# EAGLE board Motherboard V1.1 (EAGLE 9.6.2), part 1 of 2
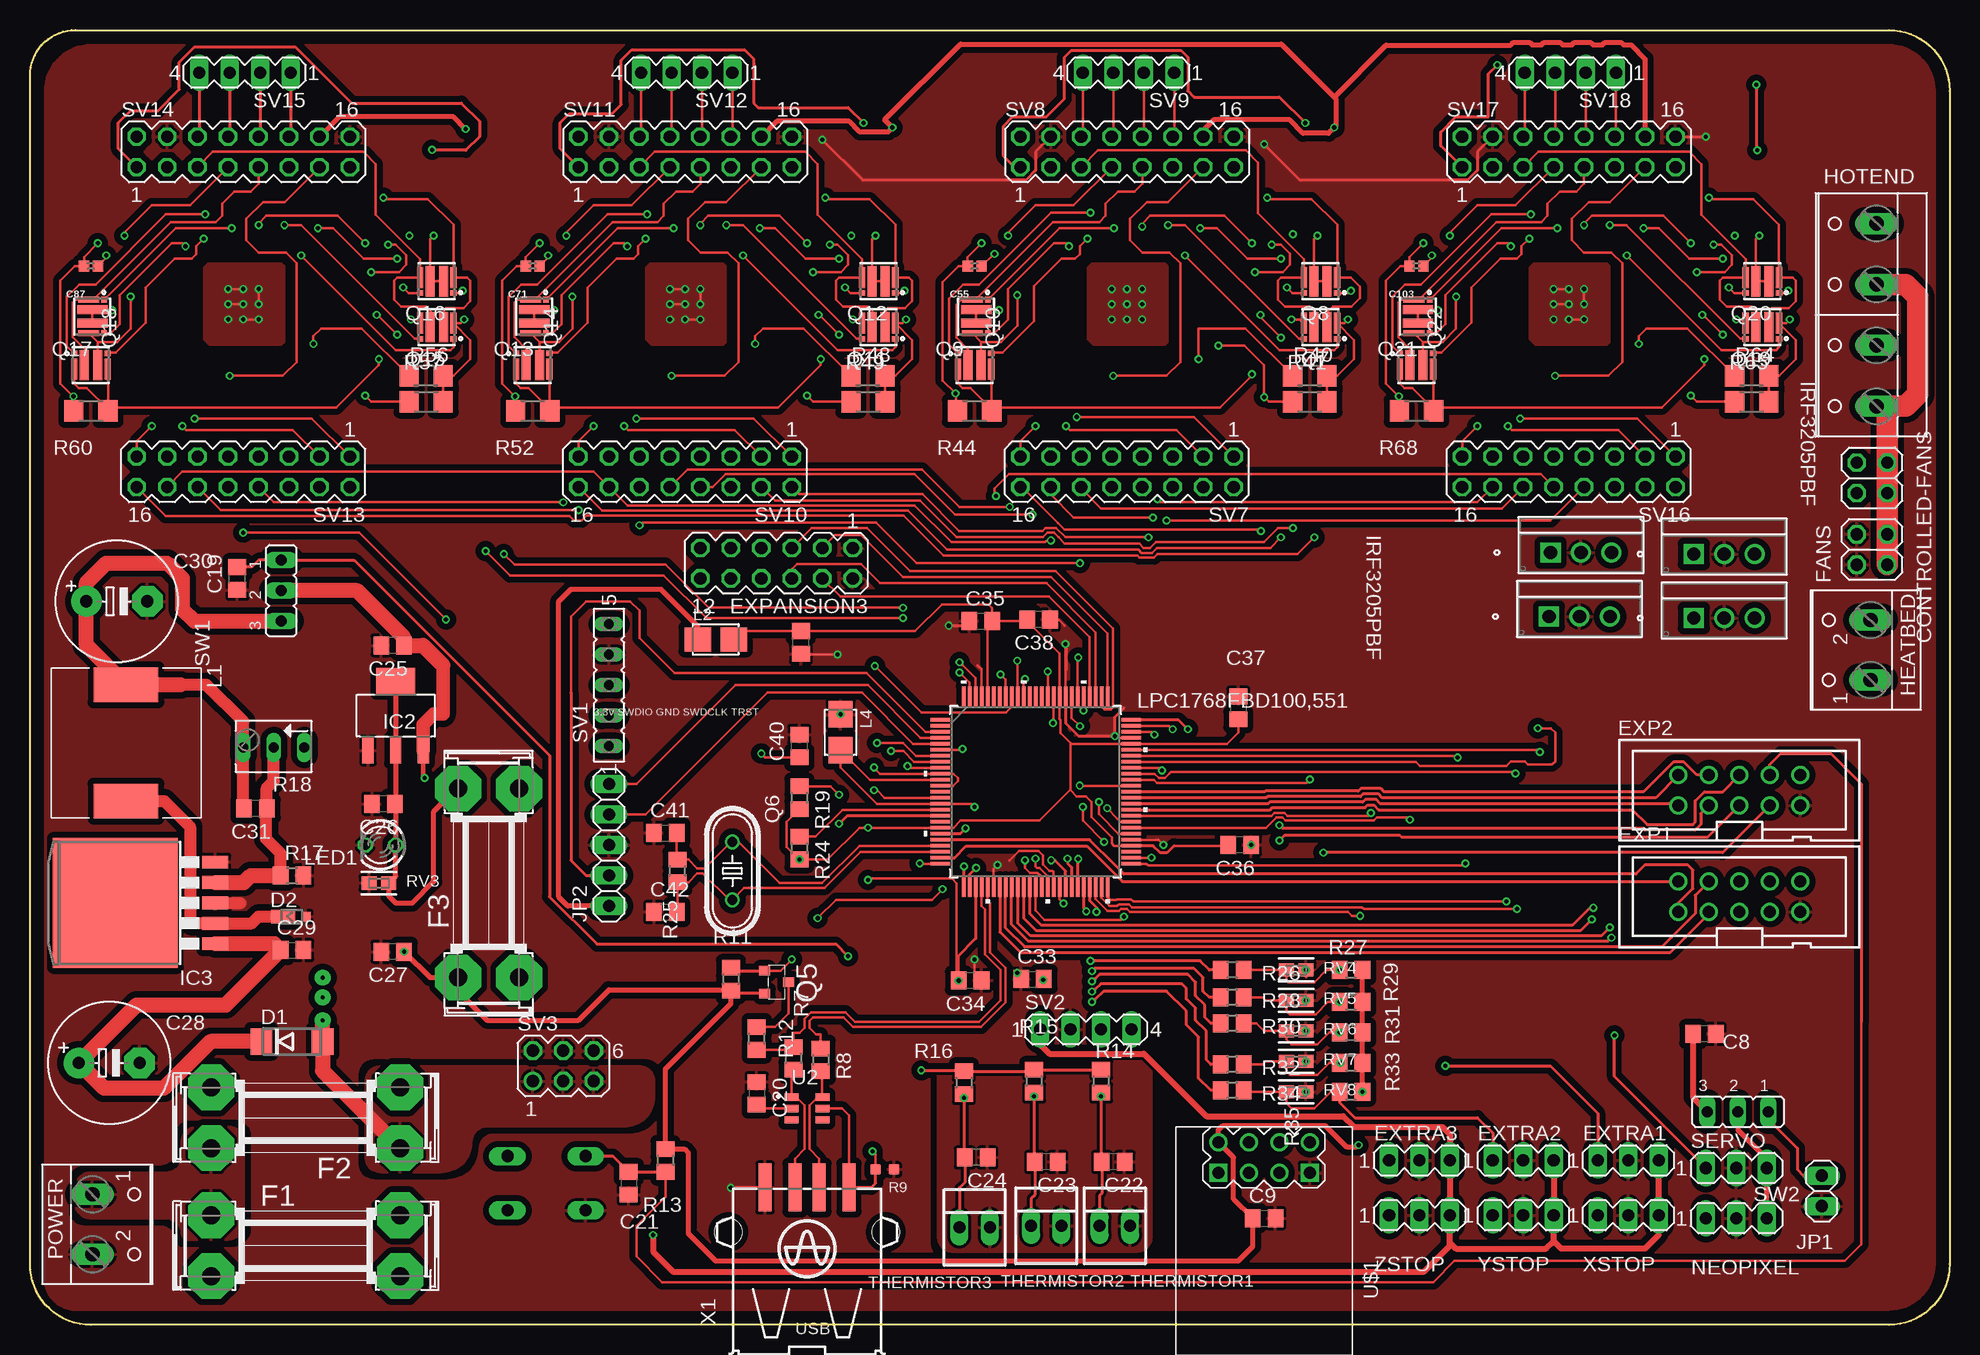
[diagram p5: board, top side]
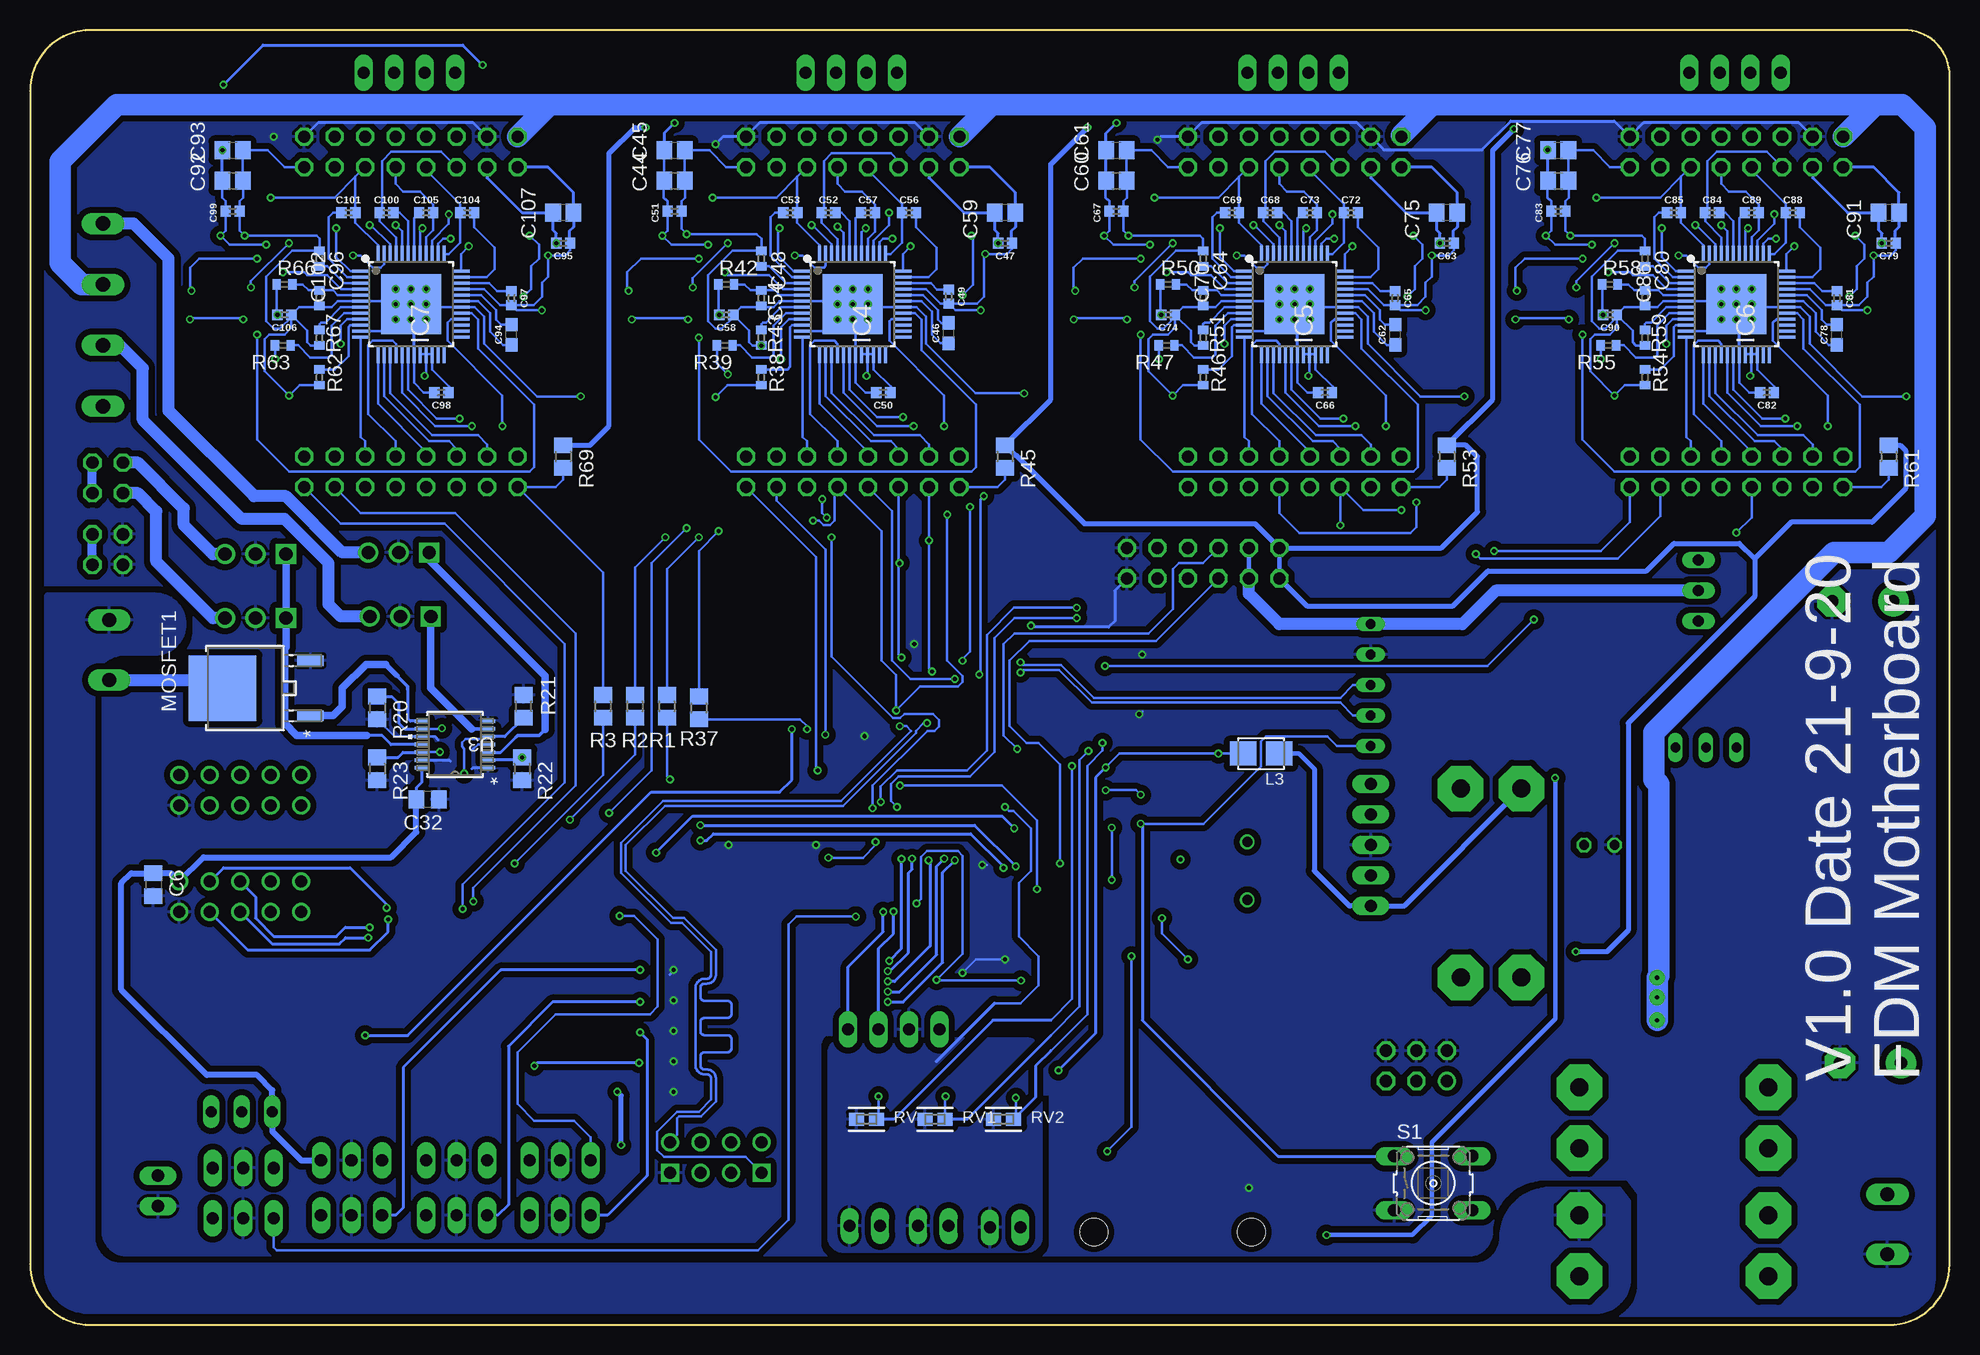
[diagram p6: board, bottom side, seen from below]

Size 160.02 x 107.95 mm. Coordinates in mm from the lower left corner, seen from the top.
Outline: 0,5.08 0,104.14 arc-90 3.81,107.95 154.94,107.95 arc-90 160.02,102.87 160.02,5.08 arc-90 154.94,0 5.08,0 arc-90 0,5.08
Copper layers (1*16): Top 0.035mm / dielectric 1.5mm / Bottom 0.035mm
Design rules "default *": minimum track width 8mil, minimum drill 0.3mm, track to track 8mil, track to pad 8mil, pad to pad 8mil, via to via 8mil, smd to smd 6mil, copper to edge 8mil, drill to drill 6mil, minimum pad ring 6mil, minimum via ring 6mil, stop-mask expansion 4mil, vias tented up to drill 0mil, thermal gap 10mil

## Footprints (pad centres in the part's own frame; a part is rotated, then mirrored left to right if it is on the bottom)
C0805 = smd 1.3 x 1.5: 1 -0.95,0; 2 0.95,0
E5-10,5 = drill 1.016 pad 2.54: + -2.54,0 | drill 1.016 pad 2.54 octagon: - 2.54,0
C0805' = smd 1.3 x 1.5: 1 -0.85,0; 2 0.85,0
0603 = smd 1.1 x 1: 1 -0.85,0; 2 0.85,0
0402 = smd 0.85 x 0.9: 1 -0.58,0; 2 0.58,0
C0402 = smd 0.7 x 0.9: 1 -0.65,0; 2 0.65,0
2X02 = drill 1.016 octagon: 1 -1.27,-1.27; 2 -1.27,1.27; 3 1.27,-1.27; 4 1.27,1.27
DO214AA = smd 1.8 x 2.2: A 2.55,0; C -2.55,0
POWERDI323 = smd 0.8 x 0.8: A 1.15,0 | smd 2 x 1.1: C -0.75,0
PAK100/2500-10 = drill 1 pad 1.422: 1 -5.08,-1.27; 2 -5.08,1.27; 3 -2.54,-1.27; 4 -2.54,1.27; 5 0,-1.27; 6 0,1.27; 7 2.54,-1.27; 8 2.54,1.27; 9 5.08,-1.27; 10 5.08,1.27
MA06-2 = drill 1.016 octagon: 1 -6.35,-1.27; 2 -6.35,1.27; 3 -3.81,-1.27; 4 -3.81,1.27; 5 -1.27,-1.27; 6 -1.27,1.27; 7 1.27,-1.27; 8 1.27,1.27; 9 3.81,-1.27; 10 3.81,1.27; 11 6.35,-1.27; 12 6.35,1.27
MA03-1 = drill 1.016 long: 1 -2.54,0; 2 0,0; 3 2.54,0
SHK20Q = drill 1.5 pad 3.81 octagon: 1A -7.874,2.54; 1B -7.874,-2.54; 2A 7.874,2.54; 2B 7.874,-2.54
W237-102 = drill 1.194 long: 1 -2.5,-1.27; 2 2.5,-1.27
W237-4P = drill 1.194 long: 1 -7.62,-0.635; 2 -2.54,-0.635; 3 2.54,-0.635; 4 7.62,-0.635
SOT223 = smd 0.95 x 2.15: 1 -2.3,-2.9; 2 0,-2.9; 3 2.3,-2.9 | smd 3.25 x 2.15: 4 0,2.9
TO263-5 = smd 1.067 x 2.159: 1 -3.404,-5.791; 2 -1.702,-5.791; 3 0,-5.791; 4 1.702,-5.791; 5 3.404,-5.791 | smd 10.8 x 10.41: 6 0,2.54
TQFP48-EP = smd 0.25 x 1.45: 1 -2.75,-4.175; 2 -2.25,-4.175; 3 -1.75,-4.175; 4 -1.25,-4.175; 5 -0.75,-4.175; 6 -0.25,-4.175; 7 0.25,-4.175; 8 0.75,-4.175; 9 1.25,-4.175; 10 1.75,-4.175; 11 2.25,-4.175; 12 2.75,-4.175; 25 2.75,4.175; 26 2.25,4.175; 27 1.75,4.175; 28 1.25,4.175; 29 0.75,4.175; 30 0.25,4.175; 31 -0.25,4.175; 32 -0.75,4.175; 33 -1.25,4.175; 34 -1.75,4.175; 35 -2.25,4.175; 36 -2.75,4.175 | smd 1.45 x 0.25: 13 4.175,-2.75; 14 4.175,-2.25; 15 4.175,-1.75; 16 4.175,-1.25; 17 4.175,-0.75; 18 4.175,-0.25; 19 4.175,0.25; 20 4.175,0.75; 21 4.175,1.25; 22 4.175,1.75; 23 4.175,2.25; 24 4.175,2.75; 37 -4.175,2.75; 38 -4.175,2.25; 39 -4.175,1.75; 40 -4.175,1.25; 41 -4.175,0.75; 42 -4.175,0.25; 43 -4.175,-0.25; 44 -4.175,-0.75; 45 -4.175,-1.25; 46 -4.175,-1.75; 47 -4.175,-2.25; 48 -4.175,-2.75 | smd 5 x 5: 49 0,0
1X02 = drill 1.016 long: 1 -1.27,0; 2 1.27,0
1X05 = drill 1.016 long: 1 -5.08,0; 2 -2.54,0; 3 0,0; 4 2.54,0; 5 5.08,0
INDP125125X600N = smd 2.9 x 5.4: 1 -4.85,0; 2 4.85,0
M1331 = smd 2.2 x 2: 1 -1.5,0; 2 1.5,0
LED3MM = drill 0.813 octagon: A -1.27,0; K 1.27,0
D-PAK_TO-252AA_INF-L = smd 0.889 x 2.184: 1 -2.29,-5.474; 3 2.29,-5.474 | smd 5.461 x 5.613: 2 0,1.854
MICRO3 = smd 0.8 x 0.9: 1 -0.95,-1; 2 0.95,-1; 3 0,1
HC49/S = drill 0.813: 1 -2.413,0; 2 2.413,0
TRANS_FDMC8030 = smd 0.52 x 0.45: 1 -1.39,0.975; 8 1.39,0.975 | smd 0.52 x 1.75: 4 -1.39,-0.325; 5 1.39,-0.325 | smd 0.75 x 2.52: 9 0.55,0; 10 -0.55,0
R0805 = smd 1.3 x 1.5: 1 -0.95,0; 2 0.95,0
R0603 = smd 0.889 x 0.889: 1 0,0.762; 2 0,-0.762
B64Y = drill 0.813 long: A 2.54,0; E -2.54,0; S 0,0
R0402 = smd 0.7 x 0.9: 1 -0.65,0; 2 0.65,0
R1206 = smd 1.6 x 1.803: 1 -1.422,0; 2 1.422,0
BOURNS_INC._CG0603MLC-3.3LE_1 = smd 1.255 x 1.106: 1 -0.826,0; 2 0.826,0
B3F-10XX = drill 1.016 long: 1 -3.251,2.261; 2 3.251,2.261; 3 -3.251,-2.261; 4 3.251,-2.261
FE05-1 = drill 0.813 long: 1 -5.08,0; 2 -2.54,0; 3 0,0; 4 2.54,0; 5 5.08,0
MA04-1 = drill 1.016 long: 1 -3.81,0; 2 -1.27,0; 3 1.27,0; 4 3.81,0
MA03-2 = drill 1.016: 1 -2.54,-1.27 | drill 1.016 octagon: 2 -2.54,1.27; 3 0,-1.27; 4 0,1.27; 5 2.54,-1.27; 6 2.54,1.27
MA08-2 = drill 1.016 octagon: 1 -8.89,-1.27; 2 -8.89,1.27; 3 -6.35,-1.27; 4 -6.35,1.27; 5 -3.81,-1.27; 6 -3.81,1.27; 7 -1.27,-1.27; 8 -1.27,1.27; 9 1.27,-1.27; 10 1.27,1.27; 11 3.81,-1.27; 12 3.81,1.27; 13 6.35,-1.27; 14 6.35,1.27; 15 8.89,-1.27; 16 8.89,1.27
JP2 = drill 0.914 long: 1 -2.54,0; 2 0,0; 3 2.54,0
22-23-2021 = drill 1 long: 1 -1.27,0; 2 1.27,0
LQFP100_14X14_NXP = smd 1.625 x 0.28: 1 -7.963,6; 2 -7.963,5.5; 3 -7.963,5; 4 -7.963,4.5; 5 -7.963,4; 6 -7.963,3.5; 7 -7.963,3; 8 -7.963,2.5; 9 -7.963,2; 10 -7.963,1.5; 11 -7.963,1; 12 -7.963,0.5; 13 -7.963,0; 14 -7.963,-0.5; 15 -7.963,-1; 16 -7.963,-1.5; 17 -7.963,-2; 18 -7.963,-2.5; 19 -7.963,-3; 20 -7.963,-3.5; 21 -7.963,-4; 22 -7.963,-4.5; 23 -7.963,-5; 24 -7.963,-5.5; 25 -7.963,-6; 51 7.963,-6; 52 7.963,-5.5; 53 7.963,-5; 54 7.963,-4.5; 55 7.963,-4; 56 7.963,-3.5; 57 7.963,-3; 58 7.963,-2.5; 59 7.963,-2; 60 7.963,-1.5; 61 7.963,-1; 62 7.963,-0.5; 63 7.963,0; 64 7.963,0.5; 65 7.963,1; 66 7.963,1.5; 67 7.963,2; 68 7.963,2.5; 69 7.963,3; 70 7.963,3.5; 71 7.963,4; 72 7.963,4.5; 73 7.963,5; 74 7.963,5.5; 75 7.963,6 | smd 0.28 x 1.625: 26 -6,-7.963; 27 -5.5,-7.963; 28 -5,-7.963; 29 -4.5,-7.963; 30 -4,-7.963; 31 -3.5,-7.963; 32 -3,-7.963; 33 -2.5,-7.963; 34 -2,-7.963; 35 -1.5,-7.963; 36 -1,-7.963; 37 -0.5,-7.963; 38 0,-7.963; 39 0.5,-7.963; 40 1,-7.963; 41 1.5,-7.963; 42 2,-7.963; 43 2.5,-7.963; 44 3,-7.963; 45 3.5,-7.963; 46 4,-7.963; 47 4.5,-7.963; 48 5,-7.963; 49 5.5,-7.963; 50 6,-7.963; 76 6,7.963; 77 5.5,7.963; 78 5,7.963; 79 4.5,7.963; 80 4,7.963; 81 3.5,7.963; 82 3,7.963; 83 2.5,7.963; 84 2,7.963; 85 1.5,7.963; 86 1,7.963; 87 0.5,7.963; 88 0,7.963; 89 -0.5,7.963; 90 -1,7.963; 91 -1.5,7.963; 92 -2,7.963; 93 -2.5,7.963; 94 -3,7.963; 95 -3.5,7.963; 96 -4,7.963; 97 -4.5,7.963; 98 -5,7.963; 99 -5.5,7.963; 100 -6,7.963
SOP95P275X110-6N = smd 1.15 x 0.6: 1 -1.3,0.95; 2 -1.3,0; 3 -1.3,-0.95; 4 1.3,-0.95; 5 1.3,0; 6 1.3,0.95
TSSOP14_4P50X5P10_ONS-L = smd 1.156 x 0.305: 1 -2.775,1.95; 2 -2.775,1.3; 3 -2.775,0.65; 4 -2.775,0; 5 -2.775,-0.65; 6 -2.775,-1.3; 7 -2.775,-1.95; 8 2.775,-1.95; 9 2.775,-1.3; 10 2.775,-0.65; 11 2.775,0; 12 2.775,0.65; 13 2.775,1.3; 14 2.775,1.95
PG-TO220-3_INF = drill 1.118 pad 1.626 square: 1 0,0 | drill 1.118 pad 1.626: 2 2.54,0; 3 5.08,0
WIRELESS-WIFI-ESP-01 = drill 1 square: A1 -8.89,3.81; D1 -8.89,-3.81 | drill 1: A2 -11.43,3.81; B1 -8.89,1.27; B2 -11.43,1.27; C1 -8.89,-1.27; C2 -11.43,-1.27; D2 -11.43,-3.81
USB-A003 = smd 1.12 x 4: 1 -3.5,14; 2 -1,14; 3 1,14; 4 3.5,14 | hole 2.3: -6.57,10.28; 6.57,10.28

## Placement (x,y rotation side)
C6  22UF  [C0805]  149.73,36.7 270 bottom
C8  22UF  [C0805]  139.57,24.26 180 top
C9  22UF  [C0805]  102.87,8.89 0 top
C19  0.1UF  [C0805]  17.27,62.23 90 top
C20  4700PF  [C0805]  60.58,19.3 270 top
C21  0.1UF  [C0805]  49.91,11.81 270 top
C22  22UF  [C0805]  90.3,13.59 180 top
C23  22UF  [C0805]  84.71,13.59 180 top
C24  22UF  [C0805]  78.87,13.97 180 top
C25  0.1UF  [C0805]  30.23,56.64 180 top
C26  10UF  [C0805]  29.46,43.43 180 top
C27  22UF  [C0805]  30.23,31.12 180 top
C28  220UF  [E5-10,5]  6.6,21.84 0 top
C29  100nF  [C0805]  21.84,31.24 0 top
C30  200UF  [E5-10,5]  7.24,60.32 0 top
C31  100nF  [C0805]  18.8,43.05 180 top
C32  0.1UF  [C0805]  126.87,43.81 180 bottom
C33  0.1UF  [C0805]  83.57,28.83 0 top
C34  0.1UF  [C0805]  78.36,28.7 180 top
C35  0.1UF  [C0805]  79.25,58.67 0 top
C36  0.1UF  [C0805]  100.84,40 180 top
C37  0.1UF  [C0805]  100.71,51.43 270 top
C38  0.1UF  [C0805]  84.07,58.8 180 top
C39  0.1UF  [C0805]  64.26,56.9 90 top
C40  0.1UF  [C0805]  64.13,48.26 90 top
C41  18PF  [C0805]  52.96,41.02 0 top
C42  18PF  [C0805]  52.96,34.42 0 top
C44  10uF  [C0805']  106.3,95.38 0 bottom
C45  10uF  [C0805']  106.3,97.92 0 bottom
C46  22nF  [0603]  83.44,82.68 90 bottom
C47  470nF  [0402]  78.74,90.17 180 bottom
C48  2.2uF  [C0402]  99.06,88.9 270 bottom
C49  0.1uF  [0402]  83.44,85.72 270 bottom
C50  0.1uF  [0402]  88.9,77.72 180 bottom
C51  0.1uF  [0402]  106.3,92.84 0 bottom
C52  0.1uF  [0402]  93.47,92.71 0 bottom
C53  0.1uF  [0402]  96.65,92.71 0 bottom
C54  2.2uF  [C0402]  99.06,85.6 90 bottom
C55  470nF  [0402]  78.74,88.27 180 top
C56  0.1uF  [0402]  86.74,92.71 0 bottom
C57  0.1uF  [0402]  90.17,92.71 0 bottom
C58  470nF  [0402]  101.98,84.2 180 bottom
C59  10uF  [C0805']  78.74,92.71 180 bottom
C60  10uF  [C0805']  69.47,95.38 0 bottom
C61  10uF  [C0805']  69.47,97.92 0 bottom
C62  22nF  [0603]  46.23,82.55 90 bottom
C63  470nF  [0402]  41.91,90.17 180 bottom
C64  2.2uF  [C0402]  62.23,88.9 270 bottom
C65  0.1uF  [0402]  46.23,85.6 270 bottom
C66  0.1uF  [0402]  52.07,77.72 180 bottom
C67  0.1uF  [0402]  69.47,92.84 0 bottom
C68  0.1uF  [0402]  56.64,92.71 0 bottom
C69  0.1uF  [0402]  59.82,92.71 0 bottom
C70  2.2uF  [C0402]  62.23,85.6 90 bottom
C71  470nF  [0402]  41.91,88.27 180 top
C72  0.1uF  [0402]  49.91,92.71 0 bottom
C73  0.1uF  [0402]  53.34,92.71 0 bottom
C74  470nF  [0402]  65.15,84.2 180 bottom
C75  10uF  [C0805']  41.91,92.71 180 bottom
C76  10uF  [C0805']  32.64,95.38 0 bottom
C77  10uF  [C0805']  32.64,97.92 0 bottom
C78  22nF  [0603]  9.4,82.55 90 bottom
C79  470nF  [0402]  5.08,90.17 180 bottom
C80  2.2uF  [C0402]  25.4,88.9 270 bottom
C81  0.1uF  [0402]  9.4,85.6 270 bottom
C82  0.1uF  [0402]  15.24,77.72 180 bottom
C83  0.1uF  [0402]  32.64,92.84 0 bottom
C84  0.1uF  [0402]  19.81,92.71 0 bottom
C85  0.1uF  [0402]  22.99,92.71 0 bottom
C86  2.2uF  [C0402]  25.4,85.6 90 bottom
C87  470nF  [0402]  5.08,88.27 180 top
C88  0.1uF  [0402]  13.08,92.71 0 bottom
C89  0.1uF  [0402]  16.51,92.71 0 bottom
C90  470nF  [0402]  28.32,84.2 180 bottom
C91  10uF  [C0805']  5.08,92.71 180 bottom
C92  10uF  [C0805']  143.13,95.38 0 bottom
C93  10uF  [C0805']  143.13,97.92 0 bottom
C94  22nF  [0603]  119.89,82.55 90 bottom
C95  470nF  [0402]  115.57,90.17 180 bottom
C96  2.2uF  [C0402]  135.89,88.9 270 bottom
C97  0.1uF  [0402]  119.89,85.6 270 bottom
C98  0.1uF  [0402]  125.73,77.72 180 bottom
C99  0.1uF  [0402]  143.13,92.84 0 bottom
C100  0.1uF  [0402]  130.3,92.71 0 bottom
C101  0.1uF  [0402]  133.48,92.71 0 bottom
C102  2.2uF  [C0402]  135.89,85.6 90 bottom
C103  470nF  [0402]  115.57,88.27 180 top
C104  0.1uF  [0402]  123.57,92.71 0 bottom
C105  0.1uF  [0402]  127,92.71 0 bottom
C106  470nF  [0402]  138.81,84.2 180 bottom
C107  10uF  [C0805']  115.57,92.71 180 bottom
CONTROLLED-FANS  [2X02]  153.54,70.61 90 top
D1  [DO214AA]  21.84,23.62 0 top
D2  PD3S160  [POWERDI323]  21.84,34.04 0 top
EXP1  2510-  [PAK100/2500-10]  142.49,35.69 0 top
EXP2  2510-  [PAK100/2500-10]  142.49,44.58 0 top
EXPANSION3  [MA06-2]  62.23,63.5 180 top
EXTRA1  [MA03-1]  133.22,13.72 0 top
EXTRA2  [MA03-1]  124.46,13.72 0 top
EXTRA3  [MA03-1]  115.82,13.72 0 top
F1  20A  [SHK20Q]  22.99,6.6 0 top
F2  10A  [SHK20Q]  22.99,17.27 180 top
F3  7.5A  [SHK20Q]  38.23,36.83 90 top
FANS  [2X02]  153.54,64.64 90 top
HEATBED  [W237-102]  152.15,56.26 90 top
HOTEND  [W237-4P]  153.29,84.2 90 top
IC2  LM1117MP-3.3  [SOT223]  30.48,50.8 0 top
IC3  LM2596S  [TO263-5]  9.65,35.18 90 top
IC4  TMC5160-TA  [TQFP48-EP]  91.44,85.09 270 bottom
IC5  TMC5160-TA  [TQFP48-EP]  54.61,85.09 270 bottom
IC6  TMC5160-TA  [TQFP48-EP]  17.78,85.09 270 bottom
IC7  TMC5160-TA  [TQFP48-EP]  128.27,85.09 270 bottom
JP1  [1X02]  149.35,11.18 90 top
JP2  swd  [1X05]  48.26,40 90 top
L1  SRR1260-331K  [INDP125125X600N]  8,48.51 270 top
L2  FB-M1331  [M1331]  57.15,57.15 0 top
L3  FB-M1331  [M1331]  57.4,47.62 180 bottom
L4  FB-M1331  [M1331]  67.56,49.4 270 top
LED1  TLLR4400  [LED3MM]  29.21,40 180 top
MOSFET1  IRLR8743PBFD-PAK_TO-252AA_INF-L  [D-PAK_TO-252AA_INF-L]  142.11,53.09 90 bottom
NEOPIXEL  [MA03-1]  142.24,8.89 0 top
POWER  [W237-102]  6.48,8.38 270 top
Q5  IRLML5203  [MICRO3]  62.23,28.58 270 top
Q6  120MHZ  [HC49/S]  58.55,37.85 270 top
Q7  FDMC8030  [TRANS_FDMC8030]  107.57,83.19 180 top
Q8  FDMC8030  [TRANS_FDMC8030]  107.57,87 180 top
Q9  FDMC8030  [TRANS_FDMC8030]  78.74,80.01 0 top
Q10  FDMC8030  [TRANS_FDMC8030]  78.87,84.07 270 top
Q11  FDMC8030  [TRANS_FDMC8030]  70.74,83.19 180 top
Q12  FDMC8030  [TRANS_FDMC8030]  70.74,87 180 top
Q13  FDMC8030  [TRANS_FDMC8030]  41.91,80.01 0 top
Q14  FDMC8030  [TRANS_FDMC8030]  42.04,84.07 270 top
Q15  FDMC8030  [TRANS_FDMC8030]  33.91,83.19 180 top
Q16  FDMC8030  [TRANS_FDMC8030]  33.91,87 180 top
Q17  FDMC8030  [TRANS_FDMC8030]  5.08,80.01 0 top
Q18  FDMC8030  [TRANS_FDMC8030]  5.21,84.07 270 top
Q19  FDMC8030  [TRANS_FDMC8030]  144.4,83.19 180 top
Q20  FDMC8030  [TRANS_FDMC8030]  144.4,87 180 top
Q21  FDMC8030  [TRANS_FDMC8030]  115.57,80.01 0 top
Q22  FDMC8030  [TRANS_FDMC8030]  115.7,84.07 270 top
R1  100  [R0805]  106.93,51.56 270 bottom
R2  100  [R0805]  109.6,51.56 270 bottom
R3  100  [R0805]  112.27,51.56 270 bottom
R7  27  [R0805]  63.63,22.23 270 top
R8  27  [R0805]  65.91,22.1 270 top
R9  SMD-RES-VARISTOR-5V-28V(0603)  [R0603]  71.25,12.95 90 top
R11  1.5K  [R0805]  58.42,28.83 270 top
R12  1.5K  [R0805]  60.58,23.88 90 top
R13  4.7K  [R0805]  52.96,13.72 270 top
R14  4.7K  [R0805]  89.28,20.32 270 top
R15  4.7K  [R0805]  83.69,20.32 270 top
R16  4.7K  [R0805]  77.85,20.19 270 top
R17  330  [R0805]  21.84,37.46 0 top
R18  10k  [B64Y]  20.32,48.13 180 top
R19  10k  [R0805]  64.13,43.94 270 top
R20  10k  [R0805]  131.06,51.43 270 bottom
R21  10k  [R0805]  118.87,51.56 90 bottom
R22  10k  [R0805]  119,46.35 270 bottom
R23  10k  [R0805]  131.06,46.35 270 bottom
R24  10k  [R0805]  64.13,39.75 270 top
R25  1M  [R0805]  53.97,37.85 90 top
R26  1k  [R0805]  100.2,29.59 180 top
R27  10K  [R0805]  110.11,29.59 0 top
R28  1k  [R0805]  100.2,27.3 180 top
R29  10K  [R0805]  110.11,26.92 0 top
R30  1k  [R0805]  100.2,25.15 180 top
R31  10K  [R0805]  110.11,24.38 0 top
R32  1k  [R0805]  100.2,21.72 180 top
R33  10K  [R0805]  110.11,21.84 0 top
R34  1k  [R0805]  100.2,19.56 180 top
R35  10K  [R0805]  110.11,19.43 0 top
R37  100  [R0805]  104.27,51.43 270 bottom
R38  47  [R0402]  99.06,78.99 90 bottom
R39  47  [R0402]  102.11,81.66 180 bottom
R40  0.075  [R1206]  106.68,79.12 0 top
R41  0.075  [R1206]  106.68,76.96 180 top
R42  2.2  [R0402]  101.98,86.74 0 bottom
R43  47  [R0402]  99.06,82.3 90 bottom
R44  0.075  [R1206]  78.74,76.2 180 top
R45  10k  [R0805]  78.74,72.39 270 bottom
R46  47  [R0402]  62.23,78.99 90 bottom
R47  47  [R0402]  65.28,81.66 180 bottom
R48  0.075  [R1206]  69.85,79.12 0 top
R49  0.075  [R1206]  69.85,76.96 180 top
R50  2.2  [R0402]  65.15,86.74 0 bottom
R51  47  [R0402]  62.23,82.3 90 bottom
R52  0.075  [R1206]  41.91,76.2 180 top
R53  10k  [R0805]  41.91,72.39 270 bottom
R54  47  [R0402]  25.4,78.99 90 bottom
R55  47  [R0402]  28.45,81.66 180 bottom
R56  0.075  [R1206]  33.02,79.12 0 top
R57  0.075  [R1206]  33.02,76.96 180 top
R58  2.2  [R0402]  28.32,86.74 0 bottom
R59  47  [R0402]  25.4,82.3 90 bottom
R60  0.075  [R1206]  5.08,76.2 180 top
R61  10k  [R0805]  5.08,72.39 270 bottom
R62  47  [R0402]  135.89,78.99 90 bottom
R63  47  [R0402]  138.94,81.66 180 bottom
R64  0.075  [R1206]  143.51,79.12 0 top
R65  0.075  [R1206]  143.51,76.96 180 top
R66  2.2  [R0402]  138.81,86.74 0 bottom
R67  47  [R0402]  135.89,82.3 90 bottom
R68  0.075  [R1206]  115.57,76.2 180 top
R69  10k  [R0805]  115.57,72.39 270 bottom
RV  BOURNS_INC._CG0603MLC-3.3LEBOURNS_INC._CG0603MLC-3.3LE_0_1  [BOURNS_INC._CG0603MLC-3.3LE_1]  90.3,17.14 0 bottom
RV1  BOURNS_INC._CG0603MLC-3.3LEBOURNS_INC._CG0603MLC-3.3LE_0_1  [BOURNS_INC._CG0603MLC-3.3LE_1]  84.58,17.14 0 bottom
RV2  BOURNS_INC._CG0603MLC-3.3LEBOURNS_INC._CG0603MLC-3.3LE_0_1  [BOURNS_INC._CG0603MLC-3.3LE_1]  78.87,17.14 0 bottom
RV3  BOURNS_INC._CG0603MLC-3.3LEBOURNS_INC._CG0603MLC-3.3LE_0_1  [BOURNS_INC._CG0603MLC-3.3LE_1]  29.08,36.83 0 top
RV4  BOURNS_INC._CG0603MLC-3.3LEBOURNS_INC._CG0603MLC-3.3LE_0_1  [BOURNS_INC._CG0603MLC-3.3LE_1]  105.54,29.59 0 top
RV5  BOURNS_INC._CG0603MLC-3.3LEBOURNS_INC._CG0603MLC-3.3LE_0_1  [BOURNS_INC._CG0603MLC-3.3LE_1]  105.54,27.05 0 top
RV6  BOURNS_INC._CG0603MLC-3.3LEBOURNS_INC._CG0603MLC-3.3LE_0_1  [BOURNS_INC._CG0603MLC-3.3LE_1]  105.54,24.51 0 top
RV7  BOURNS_INC._CG0603MLC-3.3LEBOURNS_INC._CG0603MLC-3.3LE_0_1  [BOURNS_INC._CG0603MLC-3.3LE_1]  105.54,21.97 0 top
RV8  BOURNS_INC._CG0603MLC-3.3LEBOURNS_INC._CG0603MLC-3.3LE_0_1  [BOURNS_INC._CG0603MLC-3.3LE_1]  105.54,19.43 0 top
S1  [B3F-10XX]  43.05,11.81 0 bottom
SERVO  [MA03-1]  142.24,13.08 0 top
SV1  [FE05-1]  48.26,53.34 90 top
SV2  [MA04-1]  88.01,24.64 0 top
SV3  [MA03-2]  44.45,21.59 0 top
SV7  [MA08-2]  91.44,71.12 180 top
SV8  [MA08-2]  91.44,97.79 0 top
SV9  [MA04-1]  91.57,104.39 180 top
SV10  [MA08-2]  54.61,71.12 180 top
SV11  [MA08-2]  54.61,97.79 0 top
SV12  [MA04-1]  54.74,104.39 180 top
SV13  [MA08-2]  17.78,71.12 180 top
SV14  [MA08-2]  17.78,97.79 0 top
SV15  [MA04-1]  17.91,104.39 180 top
SV16  [MA08-2]  128.27,71.12 180 top
SV17  [MA08-2]  128.27,97.79 0 top
SV18  [MA04-1]  128.4,104.39 180 top
SW1  [JP2]  20.96,61.21 270 top
SW2  [JP2]  142.37,17.78 180 top
THERMISTOR1  22-23-2021  [22-23-2021]  90.42,8.25 0 top
THERMISTOR2  22-23-2021  [22-23-2021]  84.71,8.25 0 top
THERMISTOR3  22-23-2021  [22-23-2021]  78.74,8.13 0 top
U1  LPC1768FBD100,551  [LQFP100_14X14_NXP]  83.82,44.45 0 top
U2  NUP2114UCMR6T1G  [SOP95P275X110-6N]  64.77,18.03 0 top
U3  MC74HCT125ADTR2GTSSOP14_4P50X5P10_ONS-L  [TSSOP14_4P50X5P10_ONS-L]  124.59,48.39 180 bottom
U4  IRF3205PBF  [PG-TO220-3_INF]  126.75,64.39 0 top
U5  IRF3205PBF  [PG-TO220-3_INF]  126.62,59.05 0 top
U6  IRF3205PBF  [PG-TO220-3_INF]  138.68,64.26 0 top
U7  IRF3205PBF  [PG-TO220-3_INF]  138.68,58.93 0 top
U$1  WIRELESS-WIFI-ESP-01  [WIRELESS-WIFI-ESP-01]  102.87,3.81 270 top
X1  [USB-A003]  64.77,-2.54 0 top
XSTOP  [MA03-1]  133.22,9.14 0 top
YSTOP  [MA03-1]  124.46,9.14 0 top
ZSTOP  [MA03-1]  115.82,9.14 0 top

## Tracks (layer width: path | path; a pad name or v marks a point on that pad's centre or on a via)
1A
  Top 0.203: SV18.2 129.67,99.19 SV17.10
1B
  Top 0.203: SV18.1 132.21,99.19 SV17.12
2A
  Top 0.203: SV18.3 127.13,99.19 SV17.8
2B
  Top 0.203: SV18.4 124.59,99.19 SV17.6
3.3VDC  (via drill 0.35)
  Top 0.254: 58.36,27.94 R11.2 58.67,27.62 Q5.2 | 110.62,14.86 v110.74,14.99
  Top 0.406: C27.1 33.34,28.96 F3.1A 35.69,27.81 38.1,25.4 45.72,25.4 48.26,27.94 58.36,27.94 | R11.2 58.42,26.8 52.96,21.34 R13.1 54.55,14.67 54.86,14.35 54.86,7.62 57.15,5.33 100.71,5.33 101.92,6.54 C9.1 100.33,10.48 100.33,13.97 U$1.D2 99.06,16.26 99.44,16.64 107.95,16.64 109.73,14.86 110.62,14.86 | R35.2 R33.2 R31.2 R29.2 R27.2 | SV8.14 97.79,99.57 98.68,100.46 105.01,100.46 106.12,99.34 108.23,99.34 v108.71,99.82 108.84,99.95 108.84,102.23 108.71,102.36 | SV11.14 62.23,100.33 68.3,100.33 69.16,99.47 71.53,99.47 v71.88,99.82 71.25,100.46 77.57,106.78 104.29,106.78 108.71,102.36 | v36.32,99.69 35.31,100.71 25.78,100.71 SV14.14 | 108.71,102.36 113.03,106.68 123.43,106.68 123.66,106.91 125.01,106.91 125.21,106.7 126,106.7 126.2,106.91 127.55,106.91 127.75,106.7 128.54,106.7 128.74,106.91 130.09,106.91 130.29,106.7 131.08,106.7 131.28,106.91 132.63,106.91 132.83,106.7 133.44,106.7 134.62,105.53 SV17.14
  Bottom 0.381: EXPANSION3.12 EXPANSION3.11
  Bottom 0.406: v110.74,14.99 110.74,19.12 R35.2 | EXPANSION3.12 53.59,59.94 41.4,59.94 38.48,62.86 25.27,62.86 22.99,65.15 17.53,65.15 16.26,63.88 | 16.26,63.88 16.26,60.71 26.8,50.16 26.8,32.89 28.57,31.12 C27.1 | R61.1 4.12,73.34 3.68,72.9 3.68,69.72 6.48,66.93 13.21,66.93 16.26,63.88 | R69.1 113.35,73.34 111.76,74.93 111.76,97.66 109.6,99.82 v108.71,99.82 | v71.88,99.82 74.93,96.77 74.93,77.15 R45.1 77.9,72.5 77.82,72.5 72.13,66.8 57.91,66.8 EXPANSION3.11 42.37,64.77 39.37,67.77 39.37,72.39 40.32,73.34 R53.1 38.1,77.15 38.1,97.92 v36.32,99.69
  other vias: 111.06,19.43 31.18,31.12
5V-OUT
  Top 1.016: C31.2 17.78,43.12 R18.A 17.78,50.29 14.71,53.36 12.55,53.36
  Top 1.27: 12.55,53.36 L1.1 4.7,56.67 C30.+ 4.7,61.85 6.35,63.5 11.43,63.5 12.7,62.23 12.7,59.69 13.72,58.67 SW1.3
+3.3V
  Top 0.406: IC2.4 IC2.2 30.48,43.5 | 30.48,43.37 LED1.A 30.48,37.4 RV3.2 29.91,35.75 30.48,35.18 31.88,35.18 33.66,36.96 33.66,42.8 35.56,44.7 F3.2A | JP2.1 44.83,34.92 44.07,35.69 44.07,60.32 45.09,61.34 52.58,61.34 55.65,58.27 L2.1
  Top 0.762: 30.48,43.5 C26.1 30.48,43.37
  Bottom 0.356: L3.1 54.23,47.62 52.96,46.35
  Bottom 0.406: F3.2A 45.47,34.92 JP2.1 50.04,34.92 52.96,37.85 52.96,46.35
+5V  (via drill 0.35)
  Top 0.254: ZSTOP.3 118.36,8.89 118.36,6.86
  Top 0.305: 32.78,45.73 32.77,45.72 v32.89,45.59
  Top 0.381: XSTOP.3 135.76,7.49 | IC2.3 32.78,45.73
  Top 0.508: 118.36,6.86 118.87,6.35 126.37,6.35 127,6.99 | 127,6.99 YSTOP.3 EXTRA2.3 | 135.76,7.49 134.62,6.35 127.63,6.35 127,6.99 | XSTOP.3 EXTRA1.3 | ZSTOP.3 EXTRA3.3 118.36,15.88 117.74,16.5 110.34,16.5 109.44,17.4 98.04,17.4 92.84,22.61 84.96,22.61 84.2,23.37 SV2.1 | v51.94,7.49 51.94,6.1 53.59,4.45 116.2,4.45 118.36,6.6 118.36,8.89 | C8.2 138.62,18.98 SW2.3
  Top 1.143: 34.42,54.99 34.42,50.93 33.66,50.93 32.78,50.05 IC2.3
  Top 1.27: 34.42,54.99 32.77,56.64 C25.1 31.14,56.67 31.14,57.36 27.29,61.21 SW1.2
  Bottom 0.254: U3.14 127.36,45.23 127.82,44.77 C32.2
  Bottom 0.381: EXPANSION3.9 EXPANSION3.10 | v32.89,45.59 32.89,25.53 43.18,15.24 43.18,9.1 44.78,7.49 v51.94,7.49
  Bottom 0.508: EXTRA1.3 137.41,13.72 139.83,16.13 SW2.3 139.83,19.56 141.1,20.83 145.29,20.83 152.4,27.94 152.4,36.83 151.58,37.65 C6.1 148.27,37.65 EXP1.10 145.54,38.99 129.92,38.99 127.82,41.09 C32.2
  Bottom 1.016: SW1.2 37.85,61.21 40.64,58.42 SV1.5 55.88,58.42 58.42,60.96 EXPANSION3.10
AGND  (via drill 0.35)
  Top 0.203: U1.11 70.02,45.45 L4.2 67.56,46.48 70.59,43.45 U1.15 78.47,43.45 v78.74,43.18
  Bottom 0.203: v78.74,43.18 78.41,42.85 78.02,42.85 76.58,41.41 76.58,37.85 77.6,36.83 77.6,32.38 75.95,30.73 75.95,28.32 77.47,26.8 79.63,26.8
  Bottom 0.305: 79.63,26.8 84.45,21.97
  pour Bottom (isolate 0.508): 76.96,6.1 arc-90 75.69,7.37 75.69,22.61 arc-90 76.96,23.88 92.2,23.88 arc-90 93.47,22.61 93.47,7.37 arc-90 92.2,6.1
  pour Top (isolate 0.254, rank 2): 93.47,7.37 93.47,22.61 arc90 92.2,23.88 76.96,23.88 arc90 75.69,22.61 75.69,7.37 arc90 76.96,6.1 92.2,6.1 arc90
BMA1
  Top 0.203: Q21.10 115.08,80.06 115.08,81.31 114.05,82.34 114.05,85.22 114.3,85.47 115.36,85.47 Q22.4 115.75,85.46 122.24,91.95 125.98,91.95 126.49,92.46 126.49,93.47 127.51,94.49 128.91,94.49 129.54,95.12 SV17.9
  Bottom 0.203: IC7.40 127,89.28 127,90.68 126.42,91.26 C105.2 126.42,93.4 127.51,94.49 128.91,94.49 129.54,95.12 SV17.9
BMA2  (via drill 0.35)
  Top 0.203: Q21.9 116.12,81.94 | 116.12,81.94 Q22.5 | SV17.7 123.83,93.34 120.65,93.34 118.36,91.06 v118.36,90.8 | v118.87,85.72 118.87,83.06 117.75,81.94 116.12,81.94
  Bottom 0.203: IC7.37 125.11,89.27 124.15,90.22 C104.1 124.15,93.42 127,96.27 SV17.7 | v118.36,90.8 117.6,90.04 117.6,88.9 118.24,88.27 118.24,86.36 v118.87,85.72
BMB1  (via drill 0.35)
  Top 0.203: Q19.10 145.02,83.26 145.02,84.62 145.17,84.77 146.62,84.77 147.19,85.34 147.19,87.06 146.93,87.32 Q20.4 145.79,91.7 143.64,93.85 140.08,93.85 v139.95,93.98
  Bottom 0.203: IC7.48 131.02,90 132.9,91.88 C101.2 132.9,95.7 | SV17.11 132.9,95.7 | v139.95,93.98 134.62,93.98 132.9,95.7
BMB2
  Top 0.203: SV17.5 125.73,97.79 138.3,97.79 139.32,96.77 139.32,92.53 143.01,88.84 Q20.5 141.1,87.32 140.84,87.06 140.84,85.47 141.42,84.89 143.5,84.89 143.9,84.49 143.9,83.24 Q19.9
  Bottom 0.203: IC7.45 129.52,90.66 130.88,92.02 C100.1 130.68,92.91 130.68,97.03 129.92,97.79 125.73,97.79 SV17.5
CA1
  Bottom 0.203: C105.1 128.02,92.27 IC7.42
CA2
  Bottom 0.203: IC7.35 121.96,87.34 121.28,88.01 121.28,89.79 122.99,91.5 C104.2
CB1
  Bottom 0.203: IC7.2 133.57,87.34 135.13,88.9 135.13,92.33 134.75,92.71 C101.1
CB2
  Bottom 0.203: IC7.43 128.52,92.02 129.21,92.71 C100.2
CRYSTAL_N
  Top 0.203: C42.2 53.97,34.48 R25.1 54.88,36.9 55.62,37.64 56.08,37.64 58.29,35.43 Q6.2 59.54,36.42 66.21,36.42 69.23,39.45 U1.23
CRYSTAL_P
  Top 0.203: C41.2 53.91,38.86 R25.2 54.88,38.8 55.62,38.05 56.21,38.05 58.42,40.26 Q6.1 59.05,40.26 62.48,36.83 66.04,36.83 69.16,39.95 U1.22
D_N
  Top 0.203: X1.3 65.77,13.87 64.97,14.66 64.97,18.31 65.65,18.98 U2.6 66.04,19.01 66.04,21.02 R8.2
D_P
  Top 0.203: X1.2 63.77,13.87 64.57,14.66 64.57,18.31 63.89,18.98 U2.1 63.47,21 63.73,21.27 R7.2
DIR  (via drill 0.35)
  Top 0.203: v124.21,75.56 133.98,75.56 SV16.1
  Bottom 0.203: IC7.18 128.52,77.97 126.11,75.56 v124.21,75.56
DPIN_N
  Top 0.203: R8.1 65.91,24.2 65.53,24.2 64.97,24.77 64.97,25.35 65.28,25.65 67.82,25.65 68.61,24.87 79.29,24.87 81.3,26.88 81.3,29.76 80.01,31.05 80.01,35.15 79.82,35.34 U1.30
DPIN_P
  Top 0.203: U1.29 79.32,34.92 79.6,34.63 79.6,30.89 80.9,29.59 80.9,27.05 79.12,25.27 68.77,25.27 67.99,26.06 65.11,26.06 64.57,25.52 64.57,24.77 64.13,24.33 63.63,24.33 R7.1 63.38,22.93 R12.1
DRIVERGND  (via drill 0.35)
  Top 0.203: R68.2 114.15,77.37 v114.11,77.41 113.03,78.49 113.03,87.07 114.23,88.27 C103.2 114.99,89.01 C95.2 | v138.43,77.47 138.94,76.96 R65.2 | IC7.49 v127,85.09 | v127,86.36 v128.27,86.36 | v129.54,86.36 v129.54,85.09 | v129.54,83.82 v128.27,83.82
  Bottom 0.203: IC7.19 128.02,78.55 127.2,77.72 C98.2 | SV17.15 138.81,96.52 140.21,97.92 C93.2 C92.2 142.24,95.34 142.24,93.98 142.55,93.67 C99.2 142.55,91.24 v142.11,90.8 136.14,90.8 135.89,90.55 C96.1 138.16,89.55 140.34,87.38 140.34,83.69 139.7,83.06 139.19,83.06 138.14,84.11 | 135.78,84.84 134.87,84.84 134.37,85.34 IC7.6 129.79,85.34 v129.54,85.09 v129.54,83.82 130.52,82.84 IC7.11 | 135.78,84.84 C102.1 | C106.1 137.6,84.84 135.78,84.84 | R62.1 137.56,78.34 v138.43,77.47 140.46,79.5 140.46,82.17 140.08,82.55 138.81,82.55 138.23,83.13 C106.1 | C106.1 138.14,84.11 | 138.14,84.11 136.91,82.88 136.91,81.91 136.64,81.65 R67.1 | v114.11,77.41 117.77,77.41 122.15,81.79 122.15,84.05 122.94,84.85 IC7.30 126.75,84.84 v127,85.09 v127,86.36 | v128.27,86.36 v129.54,86.36 | v128.27,83.82 v127,83.82
  Bottom 0.254: SV17.3 121.92,95.63 119,92.71 C107.2 116.42,91.27 116.15,91 C95.2 | IC7.19 128.02,83.57 v128.27,83.82
  other vias: 116.15,90.17 128.27,85.09
  pour Top: 124.97,88.14 125.35,88.52 131.44,88.52 131.7,88.27 131.7,81.91 131.44,81.66 125.48,81.66 124.97,82.17
DRIVERVBB  (via drill 0.35)
  Top 0.203: Q22.9 Q22.10 117.31,84.62 v117.35,84.58 | v116.84,89.15 116.84,88.95 C103.1 | Q20.10 Q20.9 143.85,90.51 v144.15,90.8 | v138.94,87.76 138.96,87.78 141.25,87.78 141.86,88.38 141.86,89.16 140.97,90.04 v140.34,90.04
  Top 0.254: SV17.1 117.6,98.3 117.6,99.44 118.87,100.71 121.54,100.71 121.54,104.27 v122.3,105.03 | v143.89,103.38 143.89,98 C93.1
  Bottom 0.203: IC7.33 122.15,86.34 120.83,85.02 C97.2 | C92.1 144.02,95.34 144.02,93.98 143.71,93.67 C99.1 143.71,91.24 v144.15,90.8 143.38,90.04 v140.34,90.04 | C97.2 118.05,85.02 117.35,85.72 117.35,86.87 116.84,87.38 v116.84,89.15 115.42,89.15 114.99,89.59 C95.1 | v117.35,84.58 119.45,84.58 C97.2 | IC7.4 134.09,86.34 135.25,87.5 136.91,87.5 137.16,87.76 v138.94,87.76
  Bottom 0.254: SV17.1 116.84,96.52 114.72,94.4 C107.1 114.72,91.53 115.06,91.19 115.06,90.24 C95.1 | 144.02,97.96 C93.1 C92.1 | v122.3,105.03 123.95,106.68 140.59,106.68 v143.89,103.38
  other vias: 143.98,97.92
DRIVERVSS  (via drill 0.35)
  Top 0.203: SV17.13 131.7,93.6 129.92,93.6 128.52,92.2 128.52,90.42 129.54,89.41 131.83,89.41 132.72,88.52 132.72,80.26 131.57,79.12 v127.13,79.12
  Bottom 0.203: IC7.21 IC7.20 | IC7.21 IC7.22 126.52,79.66 125.09,78.23 125.09,77.78 C98.1 | v127.13,79.12 127.02,79.23 IC7.21
E0-DIR  (via drill 0.35)
  Top 0.203: U1.49 89.32,35.58 89.98,34.92 90.6,34.92 90.76,35.08 91.62,35.08 91.87,34.82 111.04,34.82 111.19,34.67 v123.95,34.67
  Bottom 0.203: v123.95,34.67 123.95,36.7 115.44,45.21 115.44,56.77 125.48,66.8 134.11,66.8 SV16.2
E0-RX  (via drill 0.35)
  Top 0.203: SV16.10 125.93,70.92 81.58,70.92 80.39,69.72 80.39,69.22 v80.52,69.09 | v80.9,54.23 81.32,53.81 U1.93
  Bottom 0.203: v80.52,69.09 80.8,68.81 80.8,54.33 v80.9,54.23
E0-STP  (via drill 0.35)
  Top 0.203: U1.50 89.82,35.66 90.04,35.43 90.54,35.43 90.59,35.48 91.78,35.48 91.96,35.31 v123.06,35.31
  Bottom 0.203: v123.06,35.31 123.06,36.45 114.55,44.96 114.55,57.66 124.59,67.69 132.46,67.69 SV16.4
ENABLE  (via drill 0.35)
  Top 0.203: SV16.15 119.38,73.66 v120.65,74.93
  Bottom 0.203: v120.65,74.93 120.65,77.47 125.22,82.04 125.22,83.55 124.93,83.85 IC7.28
ESP_N  (via drill 0.35)
  Top 0.203: v85.26,50.16 85.32,50.23 U1.85
  Bottom 0.203: v85.26,50.16 85.55,50.16 86.18,49.53 86.18,49.36 92.26,43.28 107.09,43.28 110.36,40 110.36,37.85 106.43,33.91 105.5,33.91 102.84,31.26 102.84,29.21 arc90 103.61,28.45 103.79,28.45 arc-90 104.14,28.09 104.14,27.37 arc-90 103.79,27.02 101.9,27.02 arc90 101.55,26.66 101.55,25.94 arc90 101.9,25.59 103.79,25.59 arc-90 104.14,25.23 104.14,24.51 arc-90 103.79,24.16 101.9,24.16 arc90 101.55,23.8 101.55,23.08 arc90 101.9,22.73 103.79,22.73 arc-90 104.14,22.37 104.14,21.65 arc-90 103.79,21.3 103.61,21.3 arc90 102.84,20.53 102.84,18.63 104.1,17.37 105.9,17.37 106.08,17.2 106.08,15.84 U$1.A2
ESP_P  (via drill 0.35)
  Top 0.203: U1.82 86.82,50.61 v87.52,49.91
  Bottom 0.203: v87.52,49.91 86.97,49.91 86.59,49.53 92.43,43.69 107.25,43.69 110.77,40.17 110.77,37.68 106.59,33.5 105.66,33.5 103.25,31.09 103.25,29.21 arc90 103.61,28.85 103.79,28.85 arc-90 104.55,28.09 104.55,21.65 arc-90 103.79,20.89 103.61,20.89 arc90 103.25,20.53 103.25,18.8 104.27,17.78 106.07,17.78 107.73,16.12 107.73,14.55 107.19,14 100.36,14 U$1.D1
EXTRA1  (via drill 0.35)
  Top 0.203: v83.82,38.86 83.82,38.23 83.95,38.1 84.17,38.1 84.82,37.45 U1.40
  Top 0.254: R32.2 98.42,21.72 98.04,22.1 98.04,24.51 97.16,25.4 97.16,26.42 96.39,27.18 96.39,28.07 96.01,28.45 89.26,28.45 88.79,27.98 88.72,27.98 v88.52,27.78
  Bottom 0.254: v83.82,38.86 84.45,38.23 84.45,30.85 87.52,27.78 v88.52,27.78
EXTRA2  (via drill 0.35)
  Top 0.203: v82.93,38.73 82.93,38.1 83.34,37.69 84,37.69 84.32,37.37 U1.39
  Top 0.254: R34.2 98.42,19.56 97.41,20.57 97.41,24 96.39,25.02 96.39,26.16 94.74,27.81 89.48,27.81 88.79,27.12 88.72,27.12 v88.52,26.92
  Bottom 0.254: v82.93,38.73 83.95,37.72 83.95,30.21 87.24,26.92 v88.52,26.92
FANMOSFET
  Bottom 0.254: U3.11 129.92,48.39 130.68,49.15 131.95,49.15
  Bottom 0.61: 131.95,49.15 137.79,49.15 138.81,50.16 138.81,56.39 138.68,56.52 U7.1 U6.1
FANPWM  (via drill 0.35)
  Top 0.203: v125.86,47.75 125.66,47.95 U1.70
  Bottom 0.203: v125.86,47.75 127.35,47.75 U3.12
  Bottom 0.254: R23.1 129.35,47.3 128.92,47.74 U3.12
GND  (via drill 0.35)
  Top 0.203: U1.31 80.32,38.03 v80.64,38.35 | C34.1 78.74,29.27 v78.74,30.48 | C33.1 82.3,29.15 v82.3,29.34 | 81.66,38.73 82.42,39.5 84.08,39.5 84.45,39.12 84.45,38.39 85,37.85 85.22,37.85 85.32,37.74 U1.41 | v94.49,40 94.04,40.45 U1.55 | v67.31,55.88 64.33,55.88 C39.1 | U1.97 79.32,54.66 78.99,54.99 | U1.83 v86.32,56.77 | C38.1 85.72,58.8 86.23,58.29 | U1.72 90.58,48.95 v90.45,49.08 | X1.1 58.45,11.46 v58.42,11.43
  Top 0.254: v86.32,56.77 86.36,56.73 86.36,54.61 | RV4.2 106.36,29.01 | v76.58,58.29 77.91,58.29 C35.1 | 91.19,51.43 90.45,50.7 v90.45,49.08 87.41,49.08 86.32,50.17 86.32,50.61 U1.83 | SV17.16 v139.7,99.06 | SV8.4 83.82,97.79 83.82,96.25 83,95.43 69.42,95.43 v66.04,98.81 | SV17.4 120.65,97.79 120.65,96.25 119.83,95.43 105.87,95.43 v102.87,98.42
  Top 1.016: IC3.3 17.53,35.18
  Bottom 0.203: v80.64,38.35 80.26,38.35 | v82.3,29.34 81.15,30.48 v78.74,30.48 | v94.49,40 94.49,39.88 | R20.2 129.62,49.04 U3.10 126.25,49.04 125.98,48.77 | U3.4 122.68,48.39 123.06,48.01 | L4.1 67.31,51.16
  Bottom 0.254: U3.10 127.01,49.04 | U3.13 125.06,47.09 124.97,46.99 | U3.1 123.11,46.44 123.19,46.35 | RV4.2 106.36,29.53 106.68,29.21 | EXPANSION3.2 69.6,61.21 69.6,58.67 70.1,58.17 76.46,58.17 v76.58,58.29 | v66.04,98.81 65.79,99.06 SV11.16 62.36,100.2 49.4,100.2 SV11.4 47.17,97.97 38.98,97.97 36.59,100.35 27.96,100.35 SV14.16 25.53,100.2 12.57,100.2 SV14.4 | v102.87,98.42 102.23,99.06 SV8.16 99.19,100.2 86.23,100.2 SV8.4 | SV17.4 123.06,100.2 136.02,100.2 SV17.16
  other vias: 106.36,29.59 106.36,27.05 106.36,24.51 106.36,21.97 106.36,19.43 67.56,50.9 101.79,40
  pour Top (isolate 0.508, rank 3): 5.08,106.68 154.94,106.68 arc-90 158.75,102.87 158.75,5.08 arc-90 154.94,1.27 3.81,1.27 arc-90 1.27,3.81 1.27,102.87 arc-90
  pour Bottom (isolate 0.508, rank 3): 3.81,106.68 154.94,106.68 arc-90 158.75,102.87 158.75,3.81 arc-90 155.7,0.76 4.32,0.76 arc-90 1.27,3.81 1.27,104.14 arc-90
HA1  (via drill 0.35)
  Top 0.203: Q22.1 122.65,91.44 v127.31,91.44
  Bottom 0.203: IC7.41 127.52,91.23 v127.31,91.44
HA2  (via drill 0.35)
  Top 0.203: Q22.8 117.23,82.68 117.98,83.44 117.98,85.85 122.3,90.17 123.19,90.17 v123.44,89.92
  Bottom 0.203: v123.44,89.92 124.09,89.27 IC7.36
HB1  (via drill 0.35)
  Top 0.203: Q20.1 146.37,86.02 v146.56,86.21 | v134.5,91.42 135.78,91.42 138.3,88.9 v141.1,88.9
  Bottom 0.203: IC7.1 133.31,87.84 134.49,89.02 v134.49,91.42 v134.5,91.42 | v141.1,88.9 145.92,88.9 146.69,88.14 146.69,86.33 v146.56,86.21
HB2  (via drill 0.35)
  Top 0.203: Q20.8 142.07,86.02 v141.6,86.49 | v138.43,90.17 136.15,92.46 130.18,92.46 129.54,91.82 v129.54,91.69
  Bottom 0.203: IC7.44 129.02,91.17 v129.54,91.69 | v141.6,86.49 141.6,87 v138.43,90.17
HBMOSFET
  Bottom 0.254: U3.8 128.31,50.34 128.52,50.55 128.52,52.96
  Bottom 0.305: 129.41,54.1 128.52,53.21 128.52,52.96
  Bottom 0.406: 129.41,54.1 130.37,55.05
  Bottom 0.61: 130.37,55.05 132.02,55.05 133.98,53.09 133.98,51.56 134.75,50.8 MOSFET1.1
HBPWM  (via drill 0.35)
  Top 0.203: U1.68 115.53,46.95 115.87,46.61 123.06,46.61 123.44,46.99 124.59,46.99 124.84,46.74 126.87,46.74 127.13,46.99 127.13,49.4 126.79,49.74 v125.69,49.74
  Bottom 0.203: v125.69,49.74 125.74,49.69 U3.9
  Bottom 0.254: R20.1 129.85,52.38 129.29,51.82 129.29,50.16 128.81,49.69 U3.9
HEMOSFET1
  Bottom 0.305: U3.6 123.22,49.69
  Bottom 0.61: U5.1 126.62,53.09 123.22,49.69
HEMOSFET2
  Bottom 0.254: U3.3 120.79,47.74 119.51,49.02
  Bottom 0.305: 119.51,49.02 119.38,49.15 117.6,49.15 117.09,49.66
  Bottom 0.61: 117.09,49.66 117.09,54.1 126.75,63.75 U4.1
HEPWM1  (via drill 0.35)
  Top 0.203: 123.8,45.95 v123.83,45.97 123.7,46.1 95.12,46.1 94.99,45.97 94.62,45.6 94.1,45.6 93.75,45.95 U1.66
  Bottom 0.203: U3.5 122,48.84 123.72,48.84 124,48.57 124,48.21 123.83,48.03 v123.83,45.97
  Bottom 0.254: R21.1 120.45,49.04 U3.5
HEPWM2  (via drill 0.35)
  Top 0.203: R22.1 118.85,47.45 U1.69
  Bottom 0.254: R22.1 119.22,47.09 U3.2
  other vias: 119,47.3
LA1  (via drill 0.35)
  Top 0.203: Q21.1 113.56,81.6 113.56,85.7 114.6,86.74 115.95,86.74 121.79,92.58 v125.11,92.58
  Bottom 0.203: IC7.39 126.52,90.4 125.11,91.81 v125.11,92.58
LA2  (via drill 0.35)
  Top 0.203: v124.97,90.55 124.33,89.92 124.33,89.28 123.95,88.9 122.55,88.9 120.14,86.49 120.14,83.57 117.64,81.07 117.05,81.07 Q21.8
  Bottom 0.203: IC7.38 126.02,90.13 125.6,90.55 v124.97,90.55
LB1  (via drill 0.35)
  Top 0.203: Q19.1 145.79,81.53 145.54,81.28 140.97,81.28 v133.1,89.15
  Bottom 0.203: IC7.47 130.52,88.43 130.81,88.14 131.44,88.14 132.46,89.15 v133.1,89.15
LB2  (via drill 0.35)
  Top 0.203: Q19.8 142.56,82.21 133.08,91.69 v131.7,91.69
  Bottom 0.203: IC7.46 130.02,90.1 131.61,91.69 v131.7,91.69
MISO
  Top 0.203: U1.77 89.38,52.36 89.38,51.47 89.55,51.3 90.09,51.3 90.27,51.47 90.27,58.07 85.47,62.86 73.35,62.86 69.79,66.42 65.15,66.42 EXPANSION3.5
MOSI
  Top 0.203: U1.76 89.82,57.63 85.09,62.36 72.77,62.36 69.29,65.84 67.11,65.84 EXPANSION3.3
MOT-EN
  Bottom 0.203: R69.2 115.57,70.48 116.2,69.85 SV16.16 112.27,62.74 R3.1
MOT-MISO  (via drill 0.35)
  Top 0.203: v87.82,51.21 U1.80 | v94.74,67.06 126.75,67.06 SV16.8 | SV13.8 20.32,68.58 v44.45,68.58 | SV10.8 56.91,69.85 57.98,70.92 73.74,70.92 77.09,67.56 v83.57,67.56
  Bottom 0.203: v94.74,67.06 94.24,67.06 93.86,66.68 93.34,66.68 92.97,67.05 92.97,69.59 SV7.8 89.03,66.17 89.03,55.37 87.82,54.16 v87.82,51.21 85.81,53.22 82.67,53.22 82.3,53.59 82.3,54.11 83.57,55.38 v83.57,67.56 | v44.45,68.58 44.45,66.52 44.95,66.02 54.21,66.02 55.88,67.69 SV10.8
MOT-MOSI  (via drill 0.35)
  Top 0.203: v84.84,54.48 84.84,52.43 U1.86 | SV16.14 120.65,68.58 94.23,68.58 v93.98,68.83 | v93.6,67.31 87,67.31 85.09,69.22 SV7.14 | SV13.14 12.7,71.12 46.99,71.12 SV10.14 49.81,68.3 73.75,68.3 76.79,65.25 84.62,65.25 84.78,65.41 v85.09,65.41 v85.09,65.4
  Bottom 0.203: SV7.14 v85.09,65.4 85.09,54.74 v84.84,54.48 | v93.98,68.83 93.98,67.69 v93.6,67.31
MOT-SCK  (via drill 0.35)
  Top 0.203: U1.81 87.32,55.57 v87.38,55.63 | SV16.12 122.68,68.07 89.28,68.07 87.63,69.72 SV7.12 | SV13.12 15.9,67.92 v45.72,67.92 | v50.8,66.65 51.05,66.91 70.51,66.91 73.91,63.5 v87.53,63.5
  Bottom 0.203: v87.38,55.63 87.63,55.88 87.63,63.6 | 87.63,63.6 SV7.12 | v45.72,67.92 48.87,67.92 SV10.12 v50.8,66.65 | v87.53,63.5 87.63,63.6
MOTORMISO
  Bottom 0.203: IC7.16 129.52,81.77 129.79,82.05 131.44,82.05 131.83,81.66 131.83,75.95 129.54,73.66 SV16.7
MOTORMOSI
  Bottom 0.203: IC7.15 130.02,77.7 126.49,74.17 122.68,74.17 121.92,73.41 SV16.13
MOTORSCK
  Bottom 0.203: IC7.14 130.52,77.43 126.75,73.66 125.09,73.66 124.46,73.02 SV16.11
N$1
  Top 0.254: U1.21 88.33,40.45 90.42,38.35 91.19,37.59 133.86,37.59 134.62,38.35 138.18,38.35 138.62,37.91 138.62,36.38 137.41,35.17 EXP1.1
N$2
  Top 0.254: EXP1.2 91.06,36.96 88.09,39.93 78.03,39.93 77.05,38.95 U1.24
N$3
  Top 0.254: U1.32 80.85,36.46 80.85,32.74 82.55,31.04 136.73,31.04 139.95,34.27 EXP1.3
N$4
  Top 0.254: EXP1.4 138.81,35.81 138.81,34.29 136.02,31.5 82.92,31.5 81.32,33.09 U1.33
N$5  (via drill 0.35)
  Top 0.254: U1.34 81.82,33.37 83.21,31.98 131.52,31.98 v131.83,32.28
  Bottom 0.254: EXP1.5 139.83,31.75 134.24,31.75 133.71,32.28 v131.83,32.28
N$6  (via drill 0.35)
  Top 0.254: U1.35 82.35,36.46 82.35,33.49 83.4,32.44 131,32.44 v131.7,33.14
  Bottom 0.254: EXP1.6 141.22,35.69 141.22,33.91 139.7,32.38 134.49,32.38 133.74,33.14 v131.7,33.14
N$7  (via drill 0.35)
  Top 0.254: U1.36 82.82,33.92 83.84,32.89 129.27,32.89 v130.18,33.8
  Bottom 0.254: EXP1.7 141.86,31.24 131.7,31.24 130.18,32.77 v130.18,33.8
N$8  (via drill 0.35)
  Top 0.254: v130.3,34.77 130.03,34.77 128.6,33.35 84.27,33.35 83.32,34.3 U1.37
  Bottom 0.254: EXP1.8 143.89,38.1 133.35,38.1 130.3,35.05 v130.3,34.77
N$9  (via drill 0.35)
  Top 0.203: U1.65 93.67,45.45 93.93,45.19 106.4,45.19 v106.68,45.47
  Bottom 0.203: v106.68,45.47 106.93,45.72 R1.2
N$10  (via drill 0.35)
  Top 0.203: U1.57 103.04,41.45 103.88,42.29 104.4,42.29 104.65,42.04 112.02,42.04 112.27,42.29 114.85,42.29 v115.02,42.12
  Bottom 0.203: v115.02,42.12 109.6,47.54 R2.2
N$11
  Top 0.254: EXP2.1 137.27,43.45 112.56,43.45 112.22,43.79 111.3,43.79 111.09,43.58 103.34,43.58 103.21,43.45 U1.61
N$12
  Top 0.254: EXP2.2 135.52,43.95 112.7,43.95 112.41,44.24 111.11,44.24 110.91,44.04 103.15,44.04 103.06,43.95 U1.62
N$13  (via drill 0.35)
  Top 0.254: EXP2.3 139.27,42.62 139.27,41.72 138.81,41.26 134.62,41.26 134.48,41.4 104.39,41.4 v104.14,41.66 | v77.85,38.23 77.82,38.2 U1.26
  Bottom 0.254: v104.14,41.66 81.28,41.66 v77.85,38.23
N$14
  Top 0.254: EXP2.4 138.94,45.85 137.86,46.93 136.97,46.93 134.49,44.45 112.85,44.45 112.6,44.7 110.92,44.7 110.72,44.5 102.96,44.5 102.91,44.45 U1.63
N$15  (via drill 0.35)
  Top 0.254: EXP2.5 139.83,40.64 114.34,40.64 114.19,40.79 104.54,40.79 v104.14,40.39 | U1.27 78.32,37.55 v78.87,38.1
  Bottom 0.254: v104.14,40.39 103.61,40.39 103.05,40.95 81.61,40.95 78.87,38.2 v78.87,38.1
N$16
  Top 0.254: EXP2.6 141.1,44.45 139.57,44.45 138.81,43.69 138.81,41.91 138.62,41.72 134.81,41.72 133.58,42.95 112.41,42.95 112.03,43.33 111.49,43.33 111.28,43.13 103.53,43.13 103.36,42.95 U1.60
N$17  (via drill 0.35)
  Top 0.254: EXP2.7 141.1,39.37 v107.82,39.37 | v77.98,41.4 77.53,40.95 U1.20
  Bottom 0.254: v107.82,39.37 104.77,42.42 78.99,42.42 v77.98,41.4
N$18  (via drill 0.35)
  Top 0.203: U1.51 93.08,38.45 93.21,38.32 119.47,38.32 v119.63,38.48
  Bottom 0.203: v119.63,38.48 112.27,45.85 R3.2
N$22  (via drill 0.35)
  Top 0.203: U1.74 94.96,49.95 v95.25,49.66
  Bottom 0.203: R37.2 95.82,50.48 95.25,49.91 v95.25,49.66
N$23
  Bottom 0.203: IC4.34 84.94,86.84 84.4,86.3 C49.1
N$24
  Bottom 0.203: IC4.31 85.72,85.34 84.84,84.45 84.84,82.55 84.11,81.83 C46.1
N$25
  Bottom 0.203: IC4.32 85.59,85.84 84.33,84.58 84.33,83.82 84.03,83.53 C46.2
N$26
  Bottom 0.203: IC4.3 97,86.84 98.41,88.25 C48.2
N$27
  Bottom 0.203: IC4.5 97.52,85.84 97.93,86.25 C54.2 99.96,86.25 100.46,86.74 R42.2
N$28  (via drill 0.35)
  Top 0.203: v104.27,82.3 102.56,84 C58.2
  Bottom 0.203: C58.2 102.63,84.27 R42.1 | IC4.29 86.25,84.34 85.72,83.82 85.72,81.28 81.15,76.71 81.15,71.5 81.53,71.12 101.6,71.12 104.27,73.79 v104.27,82.3
  other vias: 102.56,84.2
N$29  (via drill 0.35)
  Top 0.203: R41.1 R40.2 108.97,79.12 110.36,80.52 110.36,82.11 Q7.4 109.55,83.51 v109.86,83.82 | Q7.5 105.87,83.82 v105.16,83.82
  Bottom 0.203: v105.16,83.82 105.28,83.95 109.86,83.95 v109.86,83.82
N$30  (via drill 0.35)
  Top 0.203: 80.16,76.33 R44.1 80.42,76.45 99.19,76.45 101.85,79.12 v101.85,79.25 | 80.16,76.33 80.16,79.65 Q9.5 | Q9.4 77.35,78.48 77.72,78.11 78.38,78.11 80.16,76.33
  Bottom 0.203: R39.2 102.76,80.15 v101.85,79.25
N$31
  Bottom 0.203: IC5.34 48.1,86.84 47.44,86.18 C65.1
N$34
  Top 0.203: C20.2 60.77,18.03 U2.2
N$35
  Bottom 1.016: HEATBED.1 144.64,53.76 MOSFET1.2
N$36
  Top 0.203: R12.2 62.1,24.83 63.23,25.95 Q5.3
N$37
  Top 1.016: R18.S 20.32,45.34 19.75,44.77 C31.1 19.69,42.99 19.69,40.51 20.89,39.3 R17.1
  Top 1.27: R17.1 18.42,37.46 17.83,36.88 IC3.4
N$38
  Top 1.27: IC3.1 20.36,31.77 C29.1 16.32,26.67 8.89,26.67 C28.+ 6.17,19.74 11.16,19.74 15.04,23.62 D1.C
N$39
  Top 1.016: L1.2 11.2,43.66 13.33,41.53 13.33,33.66 13.51,33.48 IC3.2 18.49,33.48 19.05,34.04 D2.C
N$40
  Bottom 1.016: U6.3 144.78,64.26 147.19,66.67 147.19,68.07 151,71.88 CONTROLLED-FANS.4
N$41
  Bottom 1.016: U4.3 133.98,64.39 138.68,69.09 141.35,69.09 148.46,76.2 148.46,88.9 151.38,91.82 HOTEND.4
N$42
  Bottom 1.016: U5.3 134.11,59.05 135.13,60.07 135.13,63.5 138.81,67.18 142.37,67.18 150.62,75.44 150.62,79.76 152.53,81.66 HOTEND.2
N$43
  Bottom 1.016: U7.3 144.78,58.93 149.48,63.63 149.48,67.82 151,69.34 CONTROLLED-FANS.2
N$44  (via drill 0.35)
  Top 0.203: R19.1 66.74,44.89 v67.44,44.2 | U1.14 71.24,43.95 70.61,44.58 v70.36,44.58
  Bottom 0.203: v70.36,44.58 67.82,44.58 v67.44,44.2
N$45
  Top 0.203: R24.1 65.47,40.7 67.72,42.95 U1.16
N$46
  Bottom 0.203: IC5.31 49.02,85.34 48.01,84.33 48.01,82.8 46.9,81.7 C62.1
N$47
  Bottom 0.203: IC5.32 48.76,85.84 47.5,84.58 47.5,83.82 47.08,83.4 C62.2
N$48
  Bottom 0.203: IC5.3 60.17,86.84 61.58,88.25 C64.2
N$49
  Bottom 0.203: IC5.5 60.69,85.84 61.1,86.25 C70.2 63.13,86.25 63.63,86.74 R50.2
N$50  (via drill 0.35)
  Top 0.203: v67.44,82.55 65.79,84.2 C74.2
  Bottom 0.203: C74.2 65.8,84.27 R50.1 | IC5.29 49.54,84.34 49.02,83.82 49.02,81.41 44.32,76.71 44.32,71.5 44.7,71.12 64.77,71.12 67.44,73.79 v67.44,82.55
  other vias: 65.73,84.2
N$51  (via drill 0.35)
  Top 0.203: R26.1 RV4.1 104.71,28.77 104.9,28.58 107.06,28.58 108.08,29.59 R27.1
  Bottom 0.254: R27.1 120.78,29.59 128.91,21.46 128.91,9.78 129.54,9.14 XSTOP.1
  other vias: 109.16,29.59
N$52  (via drill 0.35)
  Top 0.203: R32.1 102.74,21.72 103,21.97 RV7.1 104.71,21.15 105.03,20.83 107.31,20.83 108.33,21.84 R33.1
  Top 0.254: R33.1 v109.24,21.84 | v117.98,21.59 126.75,21.59 130.68,17.65 EXTRA1.1
  Bottom 0.254: v109.24,21.84 117.73,21.84 v117.98,21.59
N$53  (via drill 0.35)
  Top 0.203: R49.1 R48.2 72.14,79.12 73.53,80.52 73.53,82.11 Q11.4 72.72,83.51 v73.02,83.82 | Q11.5 69.04,83.82 v68.58,83.82
  Bottom 0.203: v68.58,83.82 68.71,83.95 73.02,83.95 v73.02,83.82
N$54  (via drill 0.35)
  Top 0.203: 43.33,76.33 R52.1 43.59,76.45 62.36,76.45 65.91,80.01 v65.91,80.52 | 43.33,76.33 43.33,79.65 Q13.5 | Q13.4 40.52,78.48 40.89,78.11 41.55,78.11 43.33,76.33
  Bottom 0.203: R47.2 65.93,80.53 v65.91,80.52
N$55  (via drill 0.35)
  Top 0.203: R28.1 102.74,27.3 103,27.05 RV5.1 104.71,26.23 105.03,25.91 107.19,25.91 108.2,26.92 R29.1
  Bottom 0.254: R29.1 116.46,26.92 120.14,23.24 120.14,10.03 121.03,9.14 YSTOP.1
  other vias: 109.16,26.92
N$56  (via drill 0.35)
  Top 0.203: R30.1 102.23,25.15 102.87,24.51 RV6.1 104.71,23.81 105.16,23.37 107.31,23.37 108.33,24.38 R31.1
  Bottom 0.254: R31.1 108.58,23.81 108.58,12.45 111.89,9.14 ZSTOP.1
  other vias: 109.16,24.38
N$57
  Bottom 0.203: IC6.34 11.28,86.84 10.61,86.18 C81.1
N$58
  Bottom 0.203: IC6.31 12.19,85.34 11.18,84.33 11.18,82.8 10.07,81.7 C78.1
N$59
  Bottom 0.203: IC6.32 11.93,85.84 10.67,84.58 10.67,83.82 10.25,83.4 C78.2
N$60
  Bottom 0.203: IC6.3 23.34,86.84 24.75,88.25 C80.2
N$61
  Top 0.203: R34.1 101.28,19.43 RV8.1 104.71,18.48 105.16,18.03 107.06,18.03 108.46,19.43 R35.1
  Top 0.254: R35.1 109.16,18.54 110.43,17.27 120.65,17.27 121.92,16 EXTRA2.1
N$62
  Bottom 0.203: IC6.5 23.86,85.84 24.27,86.25 C86.2 26.3,86.25 26.8,86.74 R58.2
N$63  (via drill 0.35)
  Top 0.203: v30.61,82.55 28.96,84.2 C90.2
  Bottom 0.203: C90.2 28.97,84.27 R58.1 | IC6.29 12.71,84.34 12.19,83.82 12.19,81.41 7.49,76.71 7.49,71.5 7.87,71.12 27.94,71.12 30.61,73.79 v30.61,82.55
  other vias: 28.9,84.2
N$64  (via drill 0.35)
  Top 0.203: R57.1 R56.2 35.31,79.12 36.7,80.52 36.7,82.11 Q15.4 35.88,83.51 v36.2,83.82 | Q15.5 32.21,83.82 v31.75,83.82
  Bottom 0.203: v31.75,83.82 31.88,83.95 36.2,83.95 v36.2,83.82
N$65  (via drill 0.35)
  Top 0.203: 6.5,76.33 R60.1 6.76,76.45 25.53,76.45 29.08,80.01 v29.08,80.52 | 6.5,76.33 6.5,79.65 Q17.5 | Q17.4 3.69,78.48 4.06,78.11 4.72,78.11 6.5,76.33
  Bottom 0.203: R55.2 29.1,80.53 v29.08,80.52
N$66
  Bottom 0.203: IC7.34 121.77,86.84 121.1,86.18 C97.1
N$67
  Bottom 0.203: IC7.31 122.68,85.34 121.67,84.33 121.67,82.8 120.56,81.7 C94.1
N$68
  Bottom 0.203: IC7.32 122.42,85.84 121.16,84.58 121.16,83.82 120.74,83.4 C94.2
N$69
  Bottom 0.203: IC7.3 133.83,86.84 135.24,88.25 C96.2
N$70
  Bottom 0.203: IC7.5 134.35,85.84 134.76,86.25 C102.2 136.79,86.25 137.29,86.74 R66.2
N$71  (via drill 0.35)
  Top 0.203: v141.1,82.55 139.45,84.2 C106.2
  Bottom 0.203: C106.2 139.46,84.27 R66.1 | IC7.29 123.2,84.34 122.68,83.82 122.68,81.41 117.98,76.71 117.98,71.5 118.36,71.12 138.43,71.12 141.1,73.79 v141.1,82.55
  other vias: 139.39,84.2
N$72  (via drill 0.35)
  Top 0.203: R65.1 R64.2 145.8,79.12 147.19,80.52 147.19,82.11 Q19.4 146.38,83.51 v146.69,83.82 | Q19.5 142.7,83.82 v142.24,83.82
  Bottom 0.203: v142.24,83.82 142.37,83.95 146.69,83.95 v146.69,83.82
N$73  (via drill 0.35)
  Top 0.203: 116.99,76.33 R68.1 117.25,76.45 136.02,76.45 139.57,80.01 v139.57,80.52 | 116.99,76.33 116.99,79.65 Q21.5 | Q21.4 114.18,78.48 114.55,78.11 115.21,78.11 116.99,76.33
  Bottom 0.203: R63.2 139.59,80.53 v139.57,80.52
NPOWER
  Top 0.406: SW2.2 142.37,16.26 144.78,13.84 SERVO.3 NEOPIXEL.3
P0.26  (via drill 0.35)
  Top 0.203: v77.72,48.01 77.67,47.95 U1.6
  Bottom 0.203: EXPANSION3.7 62.23,63.5 64.26,63.5 64.77,62.99 64.77,59.69 66.8,57.66 77.98,57.66 78.87,56.77 78.87,49.15 v77.72,48.01
P0.27  (via drill 0.35)
  Top 0.203: v74.17,38.48 74.2,38.45 U1.25
  Bottom 0.203: EXPANSION3.8 66.17,57.02 76.71,57.02 78.36,55.37 78.36,49.91 76.96,48.51 75.95,48.51 74.17,46.74 v74.17,38.48
P38  (via drill 0.35)
  Top 0.203: U1.38 83.82,34.54 84.58,33.78 90.93,33.78 v91.19,34.04
  Bottom 0.203: NEOPIXEL.1 139.7,6.48 139.45,6.22 99.31,6.22 96.77,8.76 96.77,33.4 96.14,34.04 v91.19,34.04
POWERIN
  pour Top: 3.81,11.43 arc-90 5.08,12.7 10.16,12.7 11.43,12.7 arc90 12.7,13.97 12.7,15.24 arc-90 13.97,16.51 16.51,16.51 arc-90 17.78,15.24 17.78,8.51 arc-90 16.38,7.11 13.21,7.11 arc-90 12.7,7.62 arc90 11.43,8.89 5.08,8.89 arc-90 3.81,10.16
PROBE  (via drill 0.35)
  Top 0.203: v110.87,34.1 110.17,34.1 109.86,34.42 91.7,34.42 91.45,34.67 90.92,34.67 90.77,34.52 89.92,34.52 89.81,34.52 88.82,35.51 U1.48
  Bottom 0.203: v110.87,34.1 109.66,34.1 107.7,32.13 107.7,26.54 108.33,25.91 116.2,25.91 119.38,22.73 119.38,18.41 117.98,17.02 114.68,17.02 113.28,15.62 EXTRA3.1
RESET  (via drill 0.35)
  Top 0.203: R13.2 52.96,10.67 50.55,8.25 50.55,5.71 52.7,3.56 116.97,3.56 118.75,5.33 151.26,5.33 152.65,6.73 152.65,25.4
  Top 0.254: S1.1 48.6,14.07 C21.1 R13.2 | U1.17 68.11,42.45 v67.44,41.78 | EXP2.8 145.03,46.74 145.92,47.62 150.11,47.62 152.65,45.09 152.65,25.4 152.65,25.27
  Bottom 0.203: SV1.1 51.09,48.26 51.88,49.06 57,49.06 57.44,48.62 57.44,46.56 62.22,41.78 v67.44,41.78
  Bottom 0.254: v67.44,41.78 67.31,41.65 67.31,25.4 55.98,14.07 S1.1
RX
  Bottom 0.203: IC7.13 131.02,76.79 127,72.77 SV16.9
RX0  (via drill 0.35)
  Top 0.203: U1.99 78.32,53.53 v77.47,54.38
  Bottom 0.203: SV1.2 49.73,50.8 50.8,51.87 71.49,51.87 74.23,54.61 77.24,54.61 v77.47,54.38
SCK
  Top 0.203: U1.78 88.82,57.74 84.71,61.85 70.87,61.85 69.29,63.42 63.93,63.42 63.5,62.99 EXPANSION3.6
SCL1  (via drill 0.35)
  Top 0.254: U1.47 88.32,35.38 88.9,34.8 v88.9,34.42
  Bottom 0.254: v88.9,34.42 88.9,32.77 91.82,29.84 SV2.4
SDA1  (via drill 0.35)
  Top 0.254: U1.46 87.82,34.7 v88.04,34.48
  Bottom 0.254: SV2.3 89.28,31.37 88.04,32.61 v88.04,34.48
SERVO  (via drill 0.35)
  Top 0.254: SERVO.1 132.08,20.7 v132.08,24.13 | v96.52,49.66 95.73,50.45 U1.75
  Bottom 0.254: v132.08,24.13 128.52,24.13 108.23,44.42 97.54,44.42 96.52,45.44 v96.52,49.66
SLP
  Bottom 0.203: IC7.12 132.44,74.02 132.08,73.66 SV16.5
SOFTCONNECT  (via drill 0.35)
  Top 0.203: Q5.1 62.55,29.52 v63.5,30.48 | v65.66,33.91 67.18,35.43 75.18,35.43 v76.07,36.32 | v87.5,44.96 v87.51,44.95 U1.64
  Top 0.254: R11.1 58.67,29.52 Q5.1
  Bottom 0.203: v63.5,30.48 65.66,32.64 v65.66,33.91 | v76.07,36.32 76.07,42.04 78.99,44.96 v87.5,44.96
SRAH
  Bottom 0.203: IC7.8 133.85,84.34 134.87,83.31 134.87,80.9 135.13,80.64 136.65,80.64 137.67,81.66 R63.1
SRAL
  Bottom 0.203: IC7.7 134.11,84.84 135.38,83.57 135.76,83.57 135.89,83.44 R67.2
SRBH  (via drill 0.35)
  Top 0.203: R64.1 138.15,83.06 134.75,83.06 134.11,82.42 v134.11,81.79
  Bottom 0.203: IC7.9 133.58,83.84 134.11,83.31 v134.11,81.79
SRBL